# Altium schematic sheet Analog_Input.SchDoc
size A1 portrait
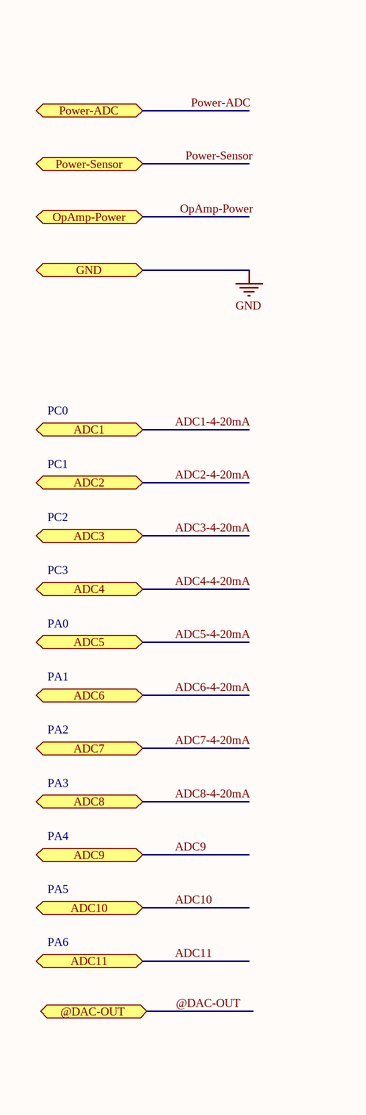
[diagram p0: Analog_Input.SchDoc, top left]
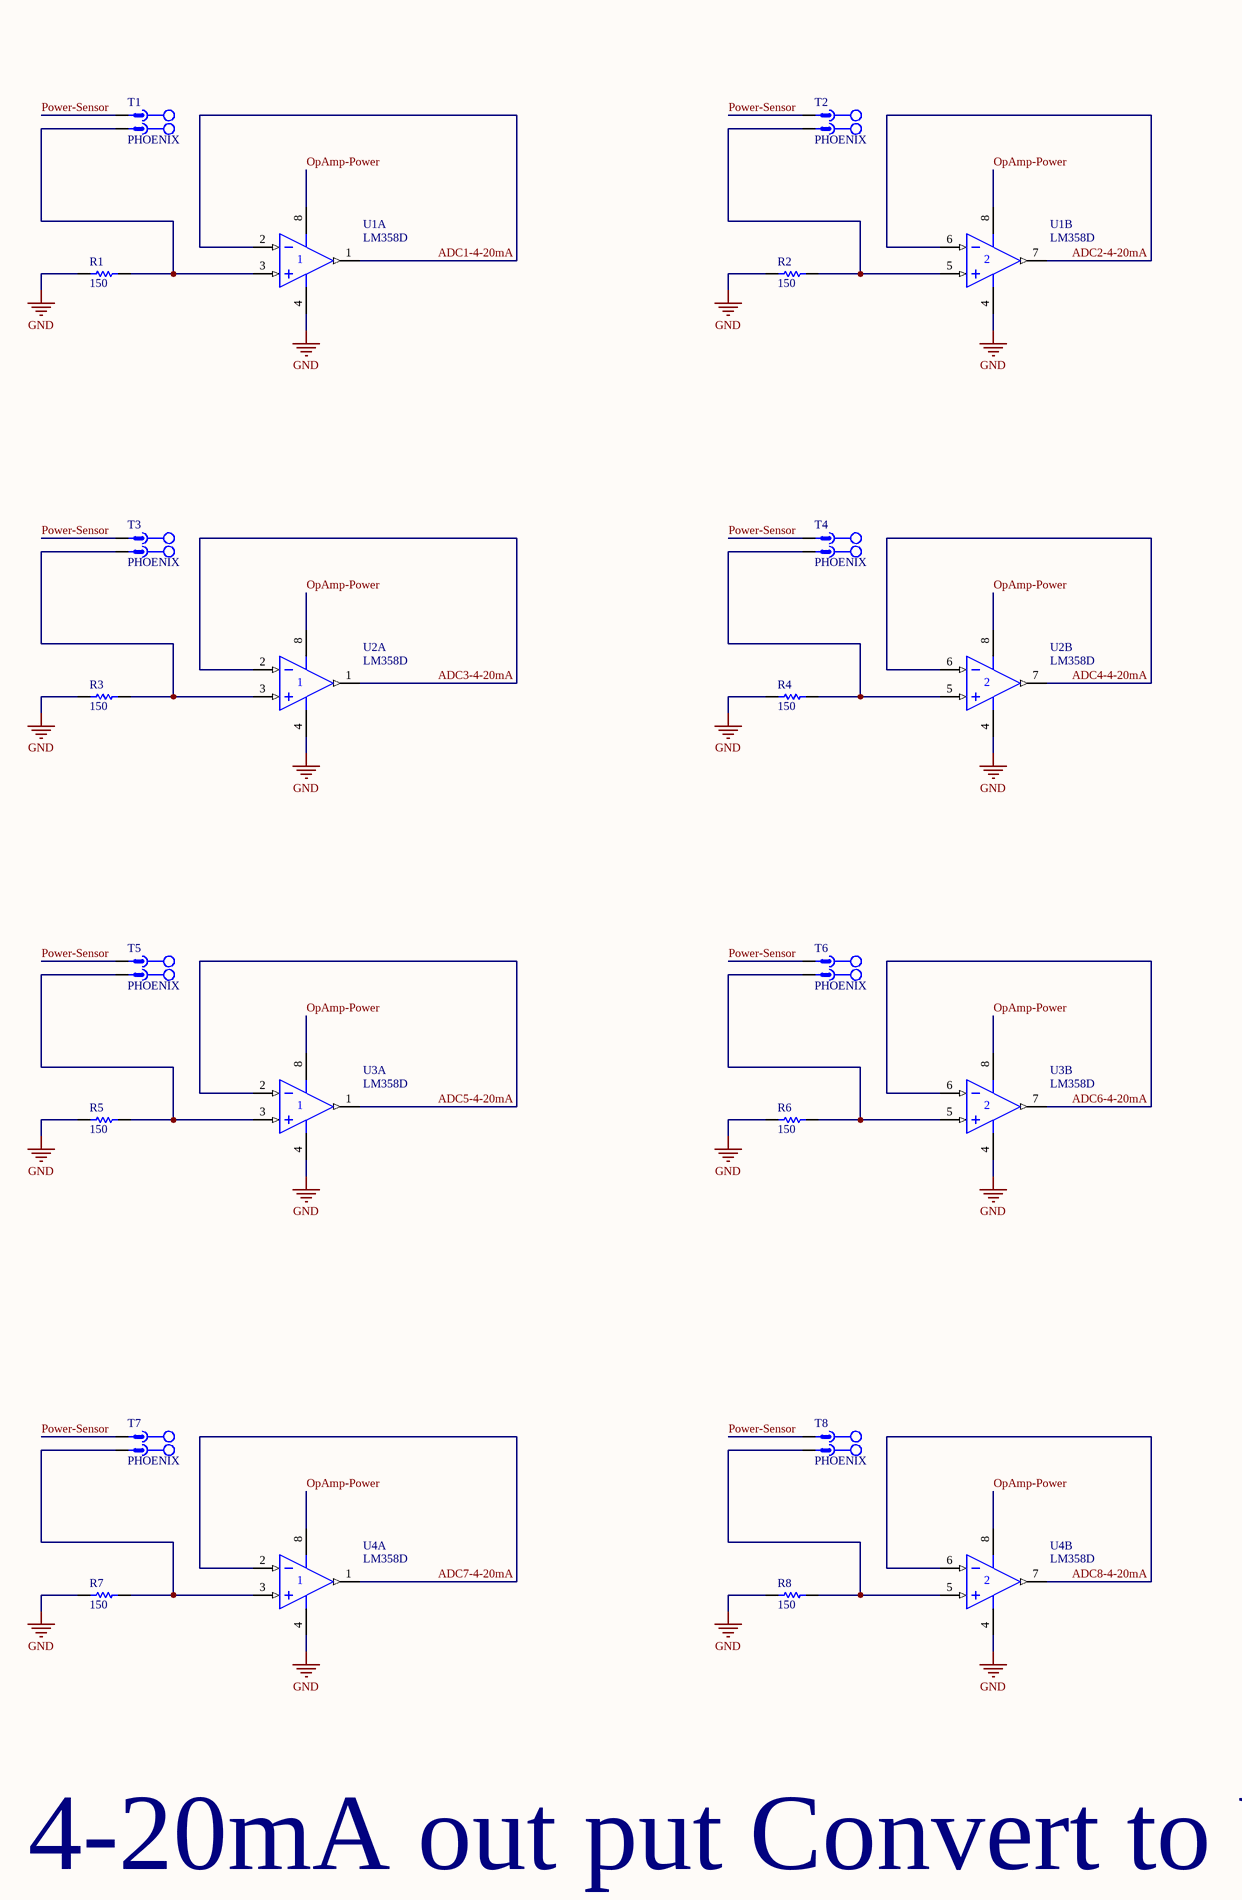
[diagram p1: Analog_Input.SchDoc, top right]
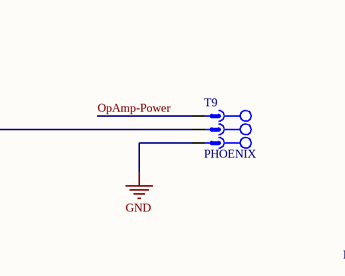
[diagram p2: Analog_Input.SchDoc, bottom left]
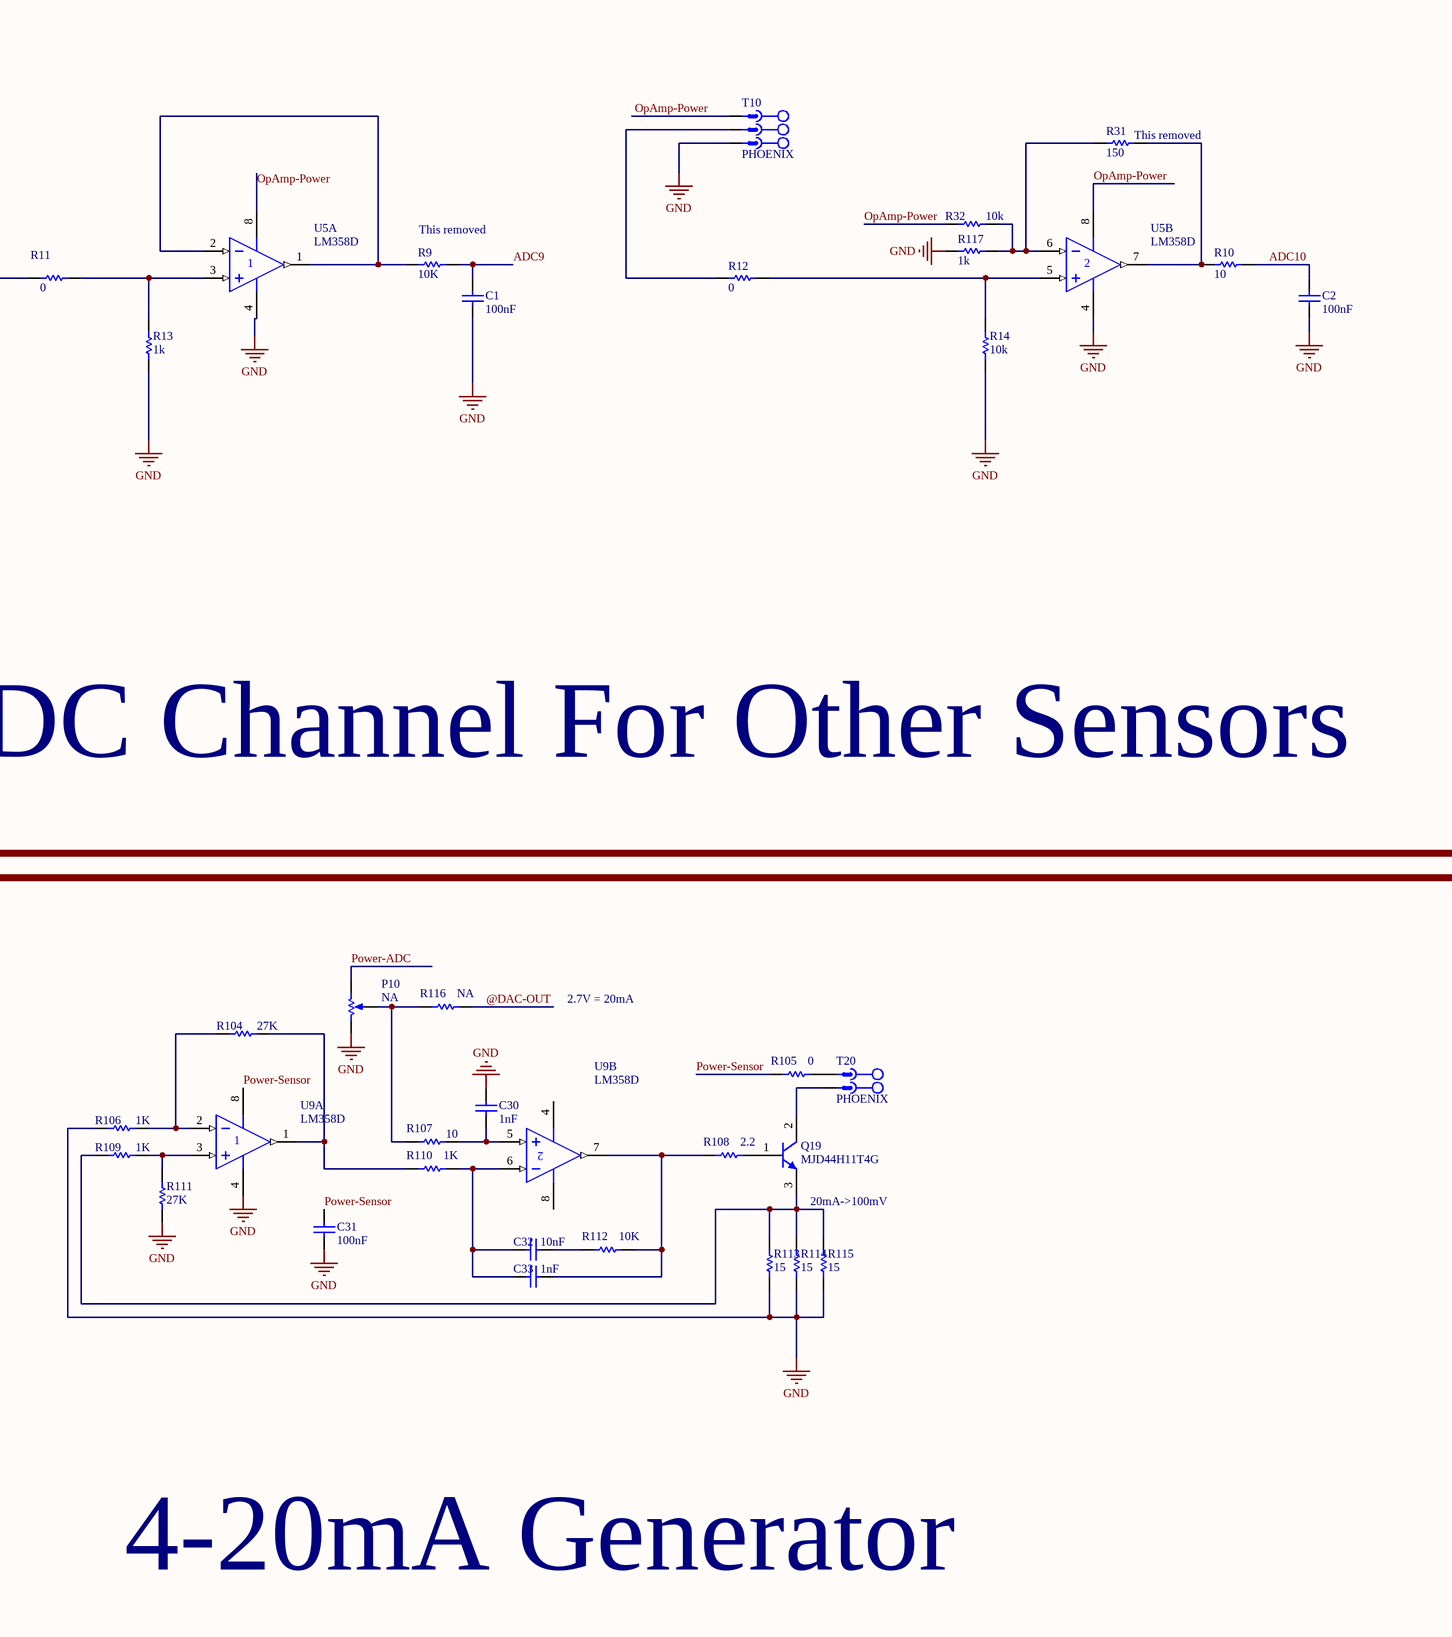
[diagram p3: Analog_Input.SchDoc, bottom right]

## Parts
C1  100nF  [CAPC3413X12N]
C2  100nF  [CAPC3413X12N]
C30  1nF  [CAPC3413X12N]
C31  100nF  [CAPC3413X12N]
C32  10nF  [CAPC3413X12N]
C33  1nF  [CAPC3413X12N]
P10  NA  [Multi Turn 02]
Q19  MJD44H11T4G  [DPACK-SMD]
R1  150  [RESC3413X04N]
R2  150  [RESC3413X04N]
R3  150  [RESC3413X04N]
R4  150  [RESC3413X04N]
R5  150  [RESC3413X04N]
R6  150  [RESC3413X04N]
R7  150  [RESC3413X04N]
R8  150  [RESC3413X04N]
R9  10K  [RESC3413X04N]
R10  10  [RESC3413X04N]
R11  0  [RESC3413X04N]
R12  0  [RESC3413X04N]
R13  1k  [RESC3413X04N]
R14  10k  [RESC3413X04N]
R31  150  [RESC3413X04N]
R32  10k  [RESC3413X04N]
R104  27K  [RESC3413X04N]
R105  0  [RESC3413X04N]
R106  1K  [RESC3413X04N]
R107  10  [RESC3413X04N]
R108  2.2  [RESC3413X04N]
R109  1K  [RESC3413X04N]
R110  1K  [RESC3413X04N]
R111  27K  [RESC3413X04N]
R112  10K  [RESC3413X04N]
R113  15  [RESC3413X04N]
R114  15  [RESC3413X04N]
R115  15  [RESC3413X04N]
R116  NA  [RESC3413X04N]
R117  1k  [RESC3413X04N]
T1  PHOENIX  [MSTB 2,5/2-G-5,08]
T2  PHOENIX  [MSTB 2,5/2-G-5,08]
T3  PHOENIX  [MSTB 2,5/2-G-5,08]
T4  PHOENIX  [MSTB 2,5/2-G-5,08]
T5  PHOENIX  [MSTB 2,5/2-G-5,08]
T6  PHOENIX  [MSTB 2,5/2-G-5,08]
T7  PHOENIX  [MSTB 2,5/2-G-5,08]
T8  PHOENIX  [MSTB 2,5/2-G-5,08]
T9  PHOENIX  [MSTB 2,5/3-G-5,08]
T10  PHOENIX  [MSTB 2,5/3-G-5,08]
T20  PHOENIX  [MSTB 2,5/2-G-5,08]
U1  LM358D  [SO-8_N]  (parts A,B of 2)
U2  LM358D  [SO-8_N]  (parts A,B of 2)
U3  LM358D  [SO-8_N]  (parts A,B of 2)
U4  LM358D  [SO-8_N]  (parts A,B of 2)
U5  LM358D  [SO-8_N]  (parts A,B of 2)
U9  LM358D  [SO-8_N]  (parts A,B of 2)

## Blocks framed on the sheet
Sensors 4-20mA out put Convert to Voltage: R1-R8 T1-T8 U1-U4
ADC Channel For Other Sensors: C1 C2 R9-R14 R31 R32 R117 T9 T10 U5
4-20mA Generator: C30-C33 P10 Q19 R104-R116 T20 U9

## Ports
@DAC-OUT (bidir), ADC1 (bidir), ADC2 (bidir), ADC3 (bidir), ADC4 (bidir), ADC5 (bidir), ADC6 (bidir), ADC7 (bidir), ADC8 (bidir), ADC9 (bidir), ADC10 (bidir), ADC11 (bidir), GND (bidir), OpAmp-Power (bidir), Power-ADC (bidir), Power-Sensor (bidir)

## Nets
GND: C1.1 C2.1 C30.1 C31.1 P10.3(BOT) R1.1 R2.1 R3.1 R4.1 R5.1 R6.1 R7.1 R8.1 R13.1 R14.1 R106.1 R111.1 R113.1 R114.1 R115.1 R117.2 T9.3 T10.3 U1.4(V-) U2.4(V-) U3.4(V-) U4.4(V-) U5.4(V-) U9.4(V-) ; port GND
@DAC-OUT: R116.2 ; port @DAC-OUT
ADC1-4-20mA: U1.1(OUT) U1.2(IN-) ; port ADC1
ADC2-4-20mA: U1.6(IN-) U1.7(OUT) ; port ADC2
ADC3-4-20mA: U2.1(OUT) U2.2(IN-) ; port ADC3
ADC4-4-20mA: U2.6(IN-) U2.7(OUT) ; port ADC4
ADC5-4-20mA: U3.1(OUT) U3.2(IN-) ; port ADC5
ADC6-4-20mA: U3.6(IN-) U3.7(OUT) ; port ADC6
ADC7-4-20mA: U4.1(OUT) U4.2(IN-) ; port ADC7
ADC8-4-20mA: U4.6(IN-) U4.7(OUT) ; port ADC8
ADC9: C1.2 R9.1 ; port ADC9
ADC10: C2.2 R10.1 ; port ADC10
ADC11: port ADC11
OpAmp-Power: R32.2 T9.1 T10.1 U1.8(V+) U2.8(V+) U3.8(V+) U4.8(V+) U5.8(V+) ; port OpAmp-Power
Power-ADC: P10.1(TOP) ; port Power-ADC
Power-Sensor: C31.2 R105.1 T1.1 T2.1 T3.1 T4.1 T5.1 T6.1 T7.1 T8.1 U9.8(V+) ; port Power-Sensor
NetC30_2: C30.2 R107.2 U9.5(IN+)
NetC32_1: C32.1 R112.1
NetC32_2: C32.2 C33.2 R110.2 U9.6(IN-)
NetC33_1: C33.1 R108.1 R112.2 U9.7(OUT)
NetP10_2: P10.2(TAP) R107.1 R116.1
NetQ19_1: Q19.1 R108.2
NetQ19_2: Q19.2 T20.2
NetQ19_3: Q19.3 R109.1 R113.2 R114.2 R115.2
NetR1_2: R1.2 T1.2 U1.3(IN+)
NetR2_2: R2.2 T2.2 U1.5(IN+)
NetR3_2: R3.2 T3.2 U2.3(IN+)
NetR4_2: R4.2 T4.2 U2.5(IN+)
NetR5_2: R5.2 T5.2 U3.3(IN+)
NetR6_2: R6.2 T6.2 U3.5(IN+)
NetR7_2: R7.2 T7.2 U4.3(IN+)
NetR8_2: R8.2 T8.2 U4.5(IN+)
NetR9_2: R9.2 U5.1(OUT) U5.2(IN-)
NetR10_2: R10.2 R31.1 U5.7(OUT)
NetR11_1: R11.1 T9.2
NetR11_2: R11.2 R13.2 U5.3(IN+)
NetR12_1: R12.1 T10.2
NetR12_2: R12.2 R14.2 U5.5(IN+)
NetR31_2: R31.2 R32.1 R117.1 U5.6(IN-)
NetR104_1: R104.1 R106.2 U9.2(IN-)
NetR104_2: R104.2 R110.1 U9.1(OUT)
NetR105_2: R105.2 T20.1
NetR109_2: R109.2 R111.2 U9.3(IN+)

## Notes on the sheet
- PC0
- PC1
- PC2
- PC3
- PA0
- PA1
- PA2
- PA3
- PA4
- PA5
- PA6
- (near R31) This removed
- (near R9) This removed
- 2.7V = 20mA
- 20mA->100mV

## Library data of the parts
C1 C2 C30-C33 = CAP SMD 0805: CAP 0805; Designer: Abbas Basereh; Desc.: CAP SMD 0805; Data: 16-12-2016
P10 = Multi-Turn: Potentiometer
Q19 = NPN
R1-R14 R31 R32 R104-R117 = RES 0805 0.125W: RES 0805; Designer: Abbas Basereh; Desc.: RES SMD 0805; Data: 16-12-2016
T1-T8 T20 = CON_Phoenix_MSTB_02: 2 Pitch: 5.08 mm Color: green Contact surface: Tin Assembly; Manufacturer: PHOENIX CONTACT; Connector type: PCB Terminal Block; designer: ABBAS BASEREH; Max Current: 12 A; Positions: 2; Voltage: 320 V; Category: Connector; ComponentLink1Description: Header, Nominal current: 12 A Rated voltage (III/2): 320 V Number of positions: 2 Pitch: 5.08 mm Color: green Contact surface: Tin Assembly: Soldering  DESIGNER:ABBAS BASEREH; ComponentLink2Description: Reference; Mounting Technology: Through-Hole; Pin Count: 2; Revision 1: 2017-3-1; Status: Unreleased; PART.NO: PHOENIX
T9 T10 = CON_Phoenix_MSTB_03: 3 Pitch: 5.08 mm Color: green Contact surface: Tin Assembly; Manufacturer: PHOENIX CONTACT; Connector type: PCB Terminal Block; designer: ABBAS BASEREH; Max Current: 12 A; Positions: 3; Voltage: 320 V; Category: Connector; ComponentLink1Description: Header, Nominal current: 12 A Rated voltage (III/2): 320 V Number of positions: 3 Pitch: 5.08 mm Color: green Contact surface: Tin Assembly: Soldering  DESIGNER:ABBAS BASEREH; ComponentLink2Description: Reference; Mounting Technology: Through-Hole; Pin Count: 3; Revision 1: 2017-3-1; Status: Unreleased; PART.NO: PHOENIX
U1-U5 U9 = LM358D: Dual Low-Power Operational Amplifier; Published: 17-Jul-2002; LatestRevisionDate: 13-Apr-2006; LatestRevisionNote: IPC-7351 Footprint Added.; DatasheetVersion: 1988; PackageReference: 751-02; Publisher: Altium Limited; PackageDescription: 8-Pin Small Outline Integrated Circuit 1.27 mm Pitch; Code_JEDEC: MS-012-AA; Code_IPC: SOIC127P600-8; ComponentLink1Description: Manufacturer Link; ComponentLink1URL: http://www.onsemi.com/site/products/parametrics/0,4446,251,00.html; ComponentLink2Description: Datasheet; ComponentLink2URL: http://www.onsemi.com/pub/Collateral/LM358-D.PDF